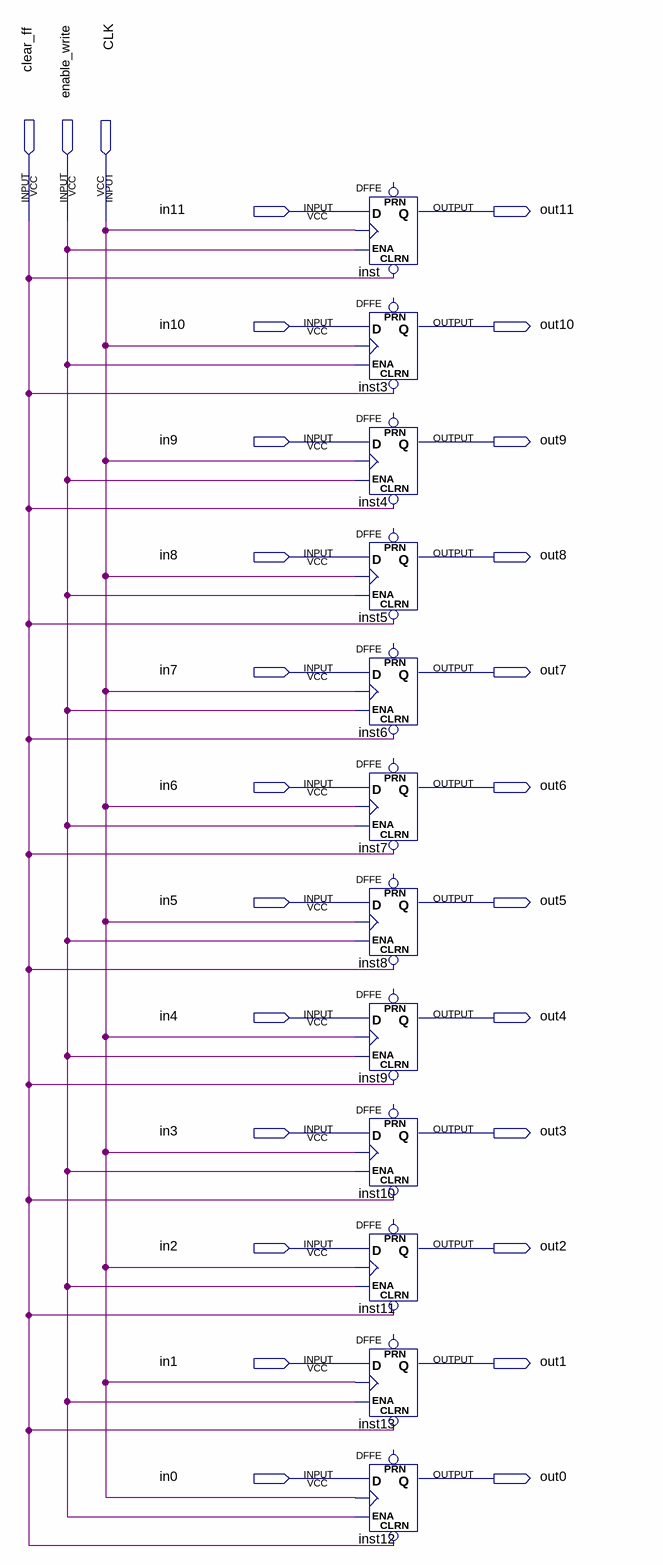
[diagram p0: schematic sheet]
// Quartus schematic memoria.bdf as structural Verilog: 12 symbols, 27 pins
module memoria (
  input  in11,
  input  clear_ff,
  input  enable_write,
  input  CLK,
  input  in10,
  input  in9,
  input  in8,
  input  in7,
  input  in6,
  input  in5,
  input  in4,
  input  in3,
  input  in2,
  input  in1,
  input  in0,
  output out11,
  output out10,
  output out9,
  output out8,
  output out7,
  output out6,
  output out5,
  output out4,
  output out3,
  output out2,
  output out1,
  output out0
);

  DFFE inst (.CLRN(clear_ff), .D(in11), .CLK(CLK), .ENA(enable_write), .Q(out11));  // open: PRN
  DFFE inst3 (.CLRN(clear_ff), .D(in10), .CLK(CLK), .ENA(enable_write), .Q(out10));  // open: PRN
  DFFE inst4 (.CLRN(clear_ff), .D(in9), .CLK(CLK), .ENA(enable_write), .Q(out9));  // open: PRN
  DFFE inst5 (.CLRN(clear_ff), .D(in8), .CLK(CLK), .ENA(enable_write), .Q(out8));  // open: PRN
  DFFE inst6 (.CLRN(clear_ff), .D(in7), .CLK(CLK), .ENA(enable_write), .Q(out7));  // open: PRN
  DFFE inst7 (.CLRN(clear_ff), .D(in6), .CLK(CLK), .ENA(enable_write), .Q(out6));  // open: PRN
  DFFE inst8 (.CLRN(clear_ff), .D(in5), .CLK(CLK), .ENA(enable_write), .Q(out5));  // open: PRN
  DFFE inst9 (.CLRN(clear_ff), .D(in4), .CLK(CLK), .ENA(enable_write), .Q(out4));  // open: PRN
  DFFE inst10 (.CLRN(clear_ff), .D(in3), .CLK(CLK), .ENA(enable_write), .Q(out3));  // open: PRN
  DFFE inst11 (.CLRN(clear_ff), .D(in2), .CLK(CLK), .ENA(enable_write), .Q(out2));  // open: PRN
  DFFE inst13 (.CLRN(clear_ff), .D(in1), .CLK(CLK), .ENA(enable_write), .Q(out1));  // open: PRN
  DFFE inst12 (.CLRN(clear_ff), .D(in0), .CLK(CLK), .ENA(enable_write), .Q(out0));  // open: PRN
endmodule
